# EasyEDA schematic SCH_PCB Schematic_2021-12-08.json
TITLE: Sheet_1; REV: 1.0; Date: 2021-11-09; Sheet: 1/1; Drawn By: sgy222; Company: Your Company
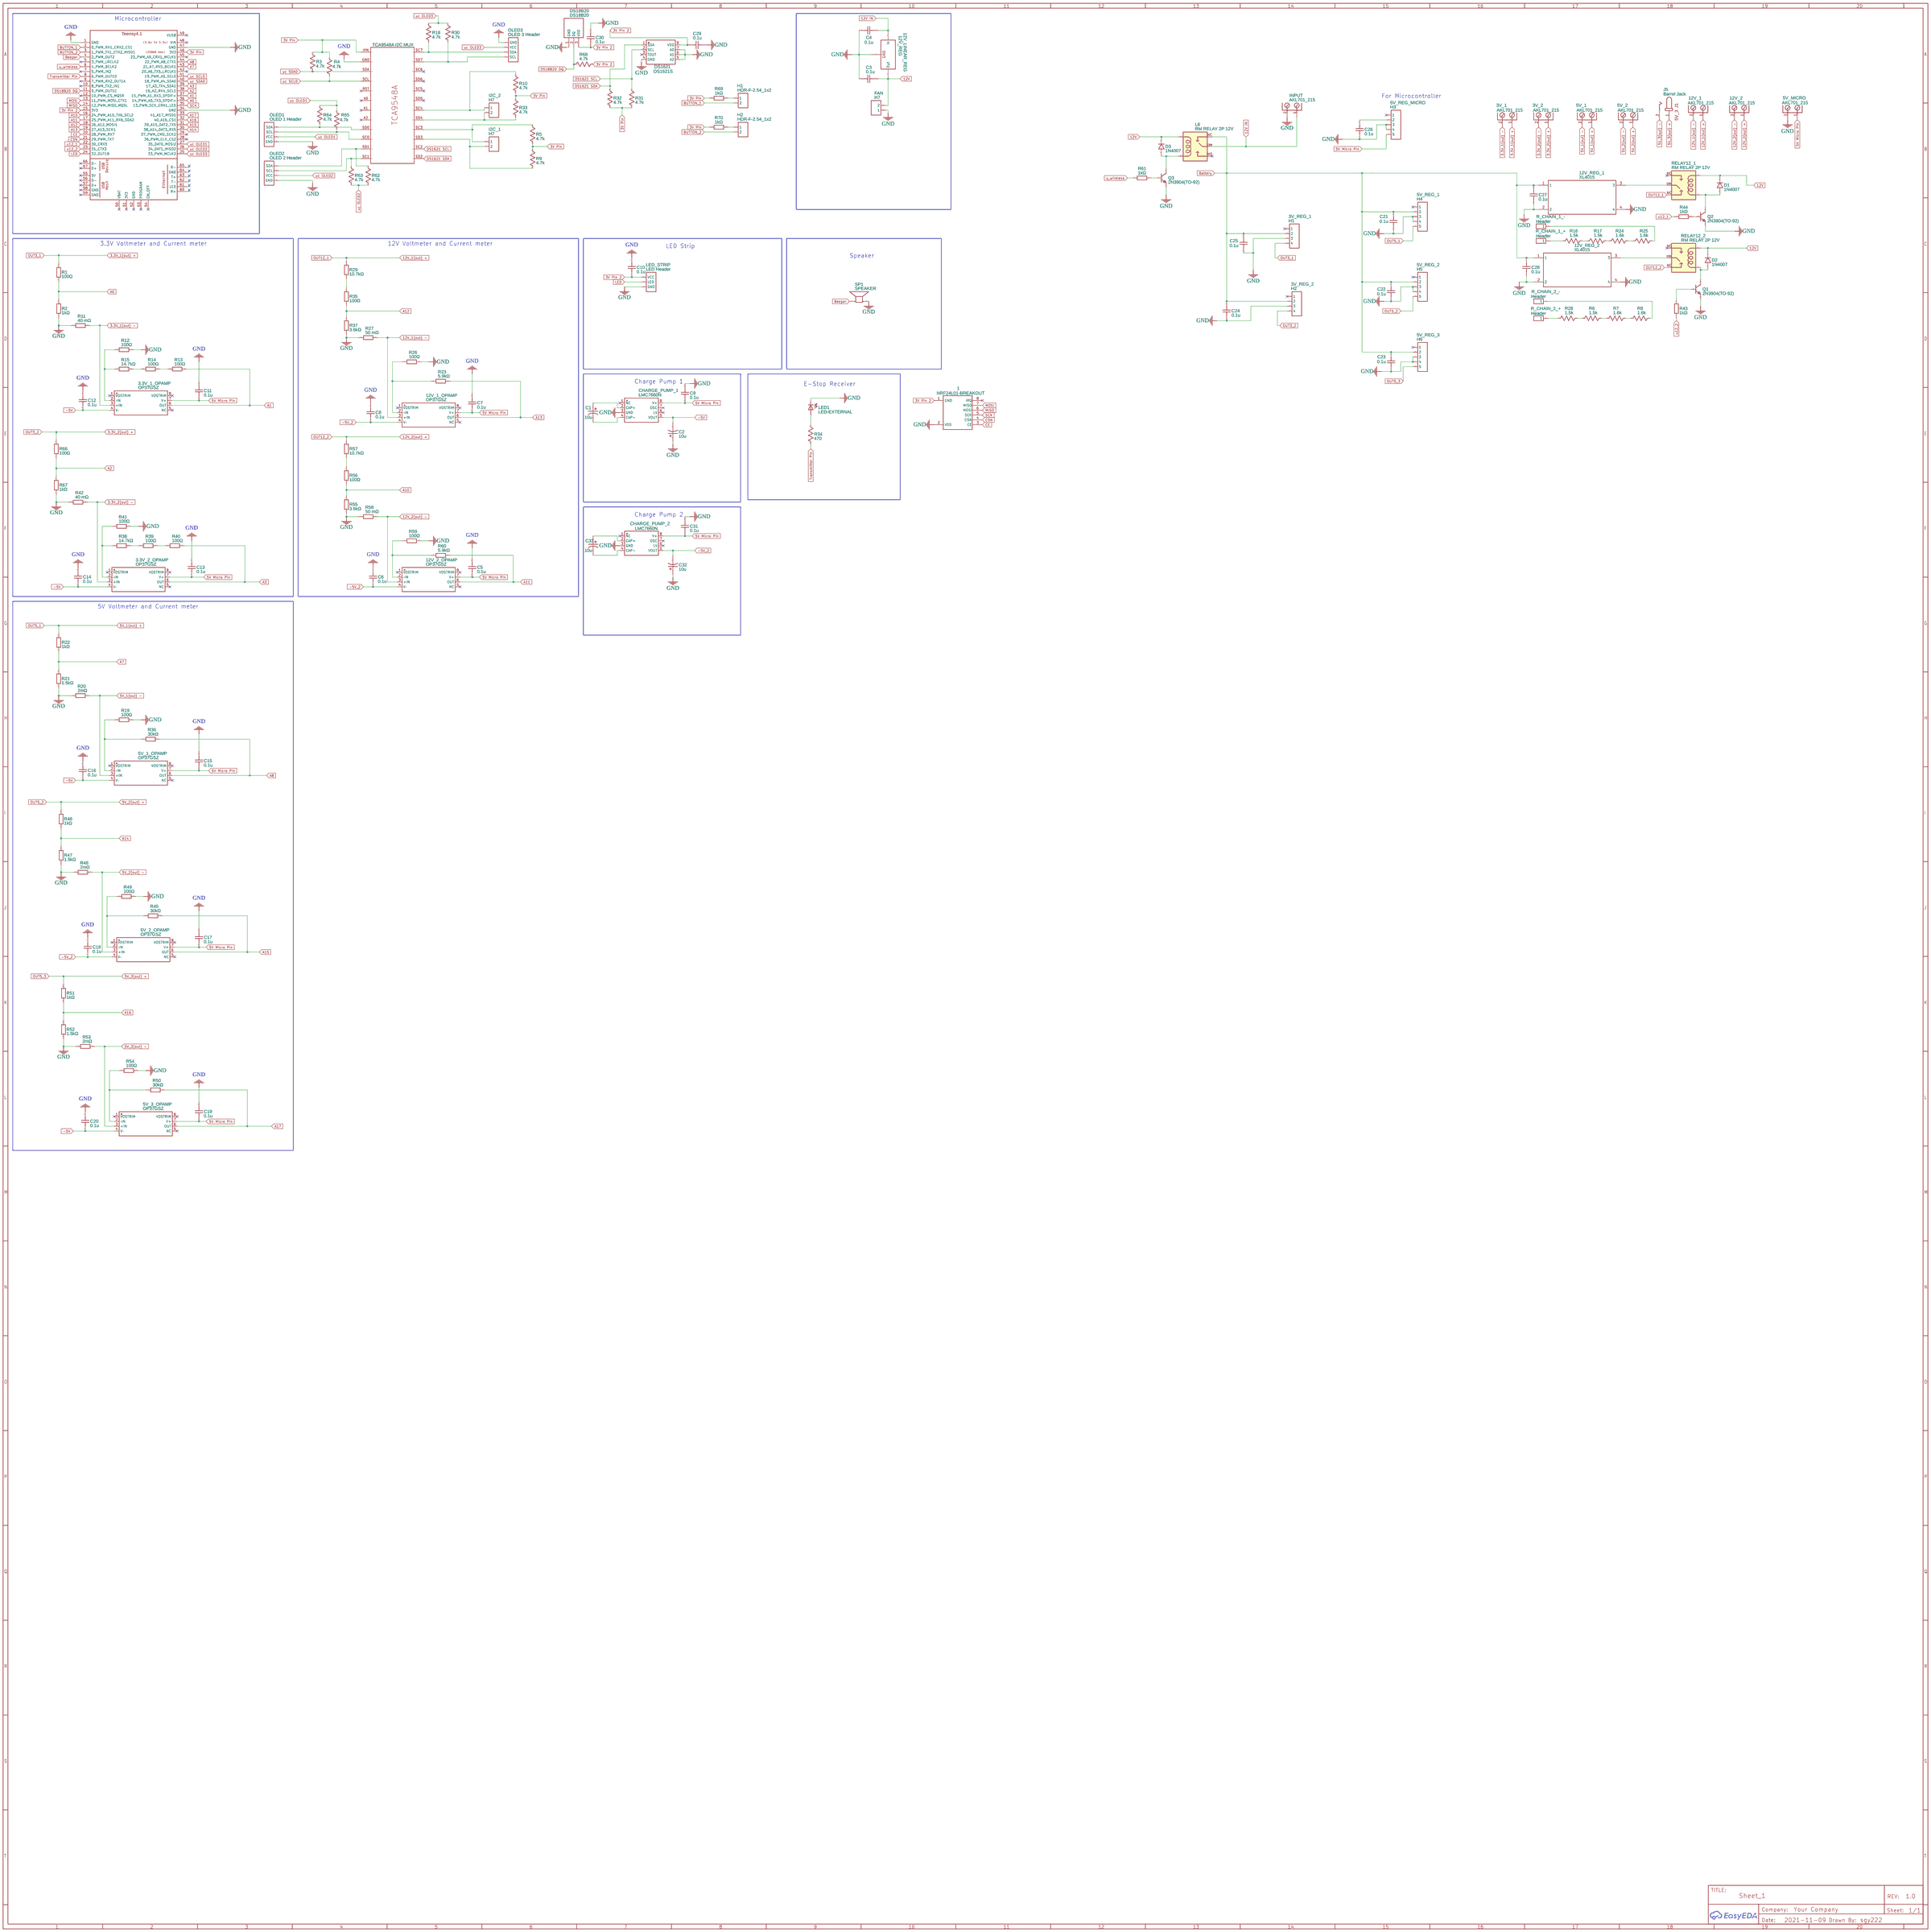
[diagram p0: schematic sheet]

## Parts
1  NRF24L01-BREAKOUT  [NRF24L01-BREAKOUT]
3.3V_1_OPAMP  OP37GSZ  [SOIC-8_L4.9-W3.9-P1.27-LS6.0-BL]
3.3V_2_OPAMP  OP37GSZ  [SOIC-8_L4.9-W3.9-P1.27-LS6.0-BL]
3V_1  AKL701_215  [AKL701_2_15]
3V_2  AKL701_215  [AKL701_2_15]
3V_REG_1  H1  [HDR-F-2.54_1X4]
3V_REG_2  H2  [HDR-F-2.54_1X4]
5V_1  AKL701_215  [AKL701_2_15]
5V_1_OPAMP  OP37GSZ  [SOIC-8_L4.9-W3.9-P1.27-LS6.0-BL]
5V_2  AKL701_215  [AKL701_2_15]
5V_2_OPAMP  OP37GSZ  [SOIC-8_L4.9-W3.9-P1.27-LS6.0-BL]
5V_3_OPAMP  OP37GSZ  [SOIC-8_L4.9-W3.9-P1.27-LS6.0-BL]
5V_MICRO  AKL701_215  [AKL701_2_15]
5V_REG_1  H4  [HDR-F-2.54_1X5]
5V_REG_2  H5  [HDR-F-2.54_1X5]
5V_REG_3  H6  [HDR-F-2.54_1X5]
5V_REG_MICRO  H3  [HDR-F-2.54_1X5]
12V_1  AKL701_215  [AKL701_2_15]
12V_1_OPAMP  OP37GSZ  [SOIC-8_L4.9-W3.9-P1.27-LS6.0-BL]
12V_2  AKL701_215  [AKL701_2_15]
12V_2_OPAMP  OP37GSZ  [SOIC-8_L4.9-W3.9-P1.27-LS6.0-BL]
12V_REG  12V_LINEAR_REG  [VOLTAGEREGULATOR-XXV]
12V_REG_1  XL4015  [XL4015]
12V_REG_2  XL4015  [XL4015]
C1  10u  [CAP-D5.0×F2.0]
C2  10u  [CAP-D5.0×F2.0]
C3  0.1u  [C0603]
C4  0.1u  [C0603]
C5  0.1u  [C0603]
C6  0.1u  [C0603]
C7  0.1u  [C0603]
C8  0.1u  [C0603]
C9  0.1u  [C0603]
C10  0.1u  [C0603]
C11  0.1u  [C0603]
C12  0.1u  [C0603]
C13  0.1u  [C0603]
C14  0.1u  [C0603]
C15  0.1u  [C0603]
C16  0.1u  [C0603]
C17  0.1u  [C0603]
C18  0.1u  [C0603]
C19  0.1u  [C0603]
C20  0.1u  [C0603]
C21  0.1u  [C0603]
C22  0.1u  [C0603]
C23  0.1u  [C0603]
C24  0.1u  [C0603]
C25  0.1u  [C0603]
C26  0.1u  [C0603]
C27  0.1u  [C0603]
C28  0.1u  [C0603]
C29  0.1u  [C0603]
C30  0.1u  [C0603]
C31  0.1u  [C0603]
C32  10u  [CAP-D5.0×F2.0]
C33  10u  [CAP-D5.0×F2.0]
CHARGE_PUMP_1  LMC7660N  [DIP-8_L9.7-W6.4-P2.54-LS7.6-BL]
CHARGE_PUMP_2  LMC7660N  [DIP-8_L9.7-W6.4-P2.54-LS7.6-BL]
D1  1N4007  [DO-41_BD2.4-L4.7-P8.70-D0.9-RD]
D2  1N4007  [DO-41_BD2.4-L4.7-P8.70-D0.9-RD]
D3  1N4007  [DO-41_BD2.4-L4.7-P8.70-D0.9-RD]
DS18B20  DS18B20  [DS18B20]
DS1621  DS1621S  [SO-8_L4.9-W3.9-P1.27-LS5.9-BL]
FAN  H7  [HDR-M-2.54_1X2]
H1  HDR-F-2.54_1x2  [HDR-F-2.54_1X2]
H2  HDR-F-2.54_1x2  [HDR-F-2.54_1X2]
I2C_1  H7  [HDR-M-2.54_1X2]
I2C_2  H7  [HDR-M-2.54_1X2]
INPUT  AKL701_215  [AKL701_2_15]
J5  Barrel Jack  [PJ-037AH]
L8  RM RELAY 2P 12V  [RM RELAY 2P 3.3V]
LED1  LED-EXTERNAL  [2PIN-HEADER-LED]
LED_STRIP  LED Header  [HDR-M-2.54_1X3]
OLED1  OLED 1 Header  [HDR-M-2.54_1X4]
OLED2  OLED 2 Header  [HDR-M-2.54_1X4]
OLED3  OLED 3 Header  [HDR-M-2.54_1X4]
Q1  2N3904(TO-92)  [TO-92-3_L5.1-W4.1-P1.27-L]
Q2  2N3904(TO-92)  [TO-92-3_L5.1-W4.1-P1.27-L]
Q3  2N3904(TO-92)  [TO-92-3_L5.1-W4.1-P1.27-L]
R1  100Ω  [R1206]
R2  1kΩ  [R1206]
R3  4.7k  [R1206]
R4  4.7k  [R1206]
R5  4.7k  [R1206]
R6  1.5k  [R_AXIAL-0.3]
R7  1.6k  [R_AXIAL-0.3]
R8  1.6k  [R_AXIAL-0.3]
R9  4.7k  [R1206]
R10  4.7k  [R1206]
R11  40 mΩ  [R1206]
R12  100Ω  [R1206]
R13  100Ω  [R1206]
R14  100Ω  [R1206]
R15  14.7kΩ  [R1206]
R16  1.5k  [R_AXIAL-0.3]
R17  1.5k  [R_AXIAL-0.3]
R18  4.7k  [R1206]
R19  100Ω  [R1206]
R20  2mΩ  [R1206]
R21  1.5kΩ  [R1206]
R22  1kΩ  [R1206]
R23  5.9kΩ  [R1206]
R24  1.6k  [R_AXIAL-0.3]
R25  1.6k  [R_AXIAL-0.3]
R26  100Ω  [R1206]
R27  50 mΩ  [R1206]
R28  1.5k  [R_AXIAL-0.3]
R29  10.7kΩ  [R1206]
R30  4.7k  [R1206]
R31  4.7k  [R1206]
R32  4.7k  [R1206]
R33  4.7k  [R1206]
R34  470  [THROUGH HOLE RESISTOR]
R35  100Ω  [R1206]
R36  30kΩ  [R0603]
R37  3.6kΩ  [R0603]
R38  14.7kΩ  [R1206]
R39  100Ω  [R1206]
R40  100Ω  [R1206]
R41  100Ω  [R1206]
R42  40 mΩ  [R1206]
R43  1kΩ  [R1206]
R44  1kΩ  [R1206]
R45  30kΩ  [R0603]
R46  1kΩ  [R1206]
R47  1.5kΩ  [R1206]
R48  2mΩ  [R1206]
R49  100Ω  [R1206]
R50  30kΩ  [R0603]
R51  1kΩ  [R1206]
R52  1.5kΩ  [R1206]
R53  2mΩ  [R1206]
R54  100Ω  [R1206]
R55  3.6kΩ  [R0603]
R56  100Ω  [R1206]
R57  10.7kΩ  [R1206]
R58  50 mΩ  [R1206]
R59  100Ω  [R1206]
R60  5.9kΩ  [R1206]
R61  1kΩ  [R1206]
R62  4.7k  [R1206]
R63  4.7k  [R1206]
R64  4.7k  [R1206]
R65  4.7k  [R1206]
R66  100Ω  [R1206]
R67  1kΩ  [R1206]
R68  4.7k  [R1206]
R69  1kΩ  [R1206]
R70  1kΩ  [R1206]
R_CHAIN_1_+  Header  [HDR-M-2.54_1X1]
R_CHAIN_1_-  Header  [HDR-M-2.54_1X1]
R_CHAIN_2_+  Header  [HDR-M-2.54_1X1]
R_CHAIN_2_-  Header  [HDR-M-2.54_1X1]
RELAY12_1  RM RELAY 2P 12V  [RM RELAY 2P 3.3V]
RELAY12_2  RM RELAY 2P 12V  [RM RELAY 2P 3.3V]
SP1  SPEAKER  [SPEAKER]
TEENSY  TEENSY4.1 COMPLETE  [TEENSY4.1 - KB]
U3  TCA9548A I2C MUX  [TCA9548A]

## Library data of the parts
1 = NRF24L01-BREAKOUT: Contributor: BLACKbox Channel
3.3V_1_OPAMP 3.3V_2_OPAMP 5V_1_OPAMP 5V_2_OPAMP 5V_3_OPAMP 12V_1_OPAMP 12V_2_OPAMP = OP37GSZ: Supplier: LCSC; Supplier Part: C690944; Manufacturer: ADI(亚德诺)/LINEAR; Contributor: LCSC
3V_1 3V_2 5V_1 5V_2 5V_MICRO 12V_1 12V_2 INPUT = AKL701_215
3V_REG_1 3V_REG_2 = HDR-F-2.54_1x4: Supplier Part: C225501; Supplier: LCSC; Contributor: LCEDA_Lib
5V_REG_1-5V_REG_3 5V_REG_MICRO = HDR-F-2.54_1x5: Supplier Part: C50950; Supplier: LCSC; Contributor: LCEDA_Lib
12V_REG = VoltageRegulator-xxV: Contributor: hctan22; Package Display: No
12V_REG_1 12V_REG_2 = XL4015: Contributor: kaleo.pretti
C1 C2 C32 C33 = CE_TH_D5.0×F2.0_US: Contributor: LCEDA_Lib
C3-C31 = C_0603_US: Contributor: LCEDA_Lib
CHARGE_PUMP_1 CHARGE_PUMP_2 = LMC7660N: Supplier: LCSC; Supplier Part: C512764; Manufacturer: HGSEMI(华冠); Contributor: LCSC; JLCPCB Part Class: Extended Part
D1-D3 = 1N4007: Supplier: LCSC; Manufacturer: SEMTECH; Supplier Part: C106903; Contributor: LCEDA_Lib
DS18B20 = DS18B20: Contributor: thomas.ragos
DS1621 = DS1621S: Supplier Part: C407894; Manufacturer: Maxim Integrated; Contributor: apol789
FAN I2C_1 I2C_2 = HDR-M-2.54_1x2: Supplier Part: C124375; Supplier: LCSC; Contributor: LCEDA_Lib
H1 H2 = HDR-F-2.54_1x2: Supplier Part: C49661; Supplier: LCSC; Contributor: LCEDA_Lib
J5 = PJ-037AH: Manufacturer: CUI; Contributor: hoff
L8 RELAY12_1 RELAY12_2 = RM RELAY 2P 3.3V
LED1 = LED-EXTERNAL: Contributor: StefMas
LED_STRIP = HDR-M-2.54_1x3: Supplier Part: C180248; Supplier: LCSC; Contributor: LCEDA_Lib
OLED1-OLED3 = HDR-M-2.54_1x4: Supplier Part: C124378; Supplier: LCSC; Contributor: LCEDA_Lib
Q1-Q3 = 2N3904(TO-92): Supplier: LCSC; Manufacturer: SEMTECH; Manufacturer Part: 2N3904; Supplier Part: C118538; Contributor: LCEDA_Lib
R1 R2 R11-R15 R19-R23 R26 R27 R29 R35 R38-R44 R46-R49 R51-R54 R56-R61 R66 R67 R69 R70 = AECR1206F110RK9: Supplier: LCSC; Supplier Part: C352159; Manufacturer: ResistorToday; Contributor: LCSC
R3-R5 R9 R10 R18 R30-R33 R62-R65 R68 = R_1206_US: Contributor: LCEDA_Lib
R6-R8 R16 R17 R24 R25 R28 = R_AXIAL-0.3_US: Contributor: LCEDA_Lib
R34 = 1k 1%: Contributor: ollie.martin
R36 R37 R45 R50 R55 = 0603WAF3022T5E: Supplier: LCSC; Supplier Part: C246852; Manufacturer: Uniroyal Elec; Contributor: LCSC; JLCPCB Part Class: Extended Part
R_CHAIN_1_+ R_CHAIN_1_- R_CHAIN_2_+ R_CHAIN_2_- = HDR-M-2.54_1x1: Supplier Part: C81276; Supplier: LCSC; Contributor: LCEDA_Lib
SP1 = SPEAKER: Contributor: dthal
TEENSY = TEENSY4.1 COMPLETE: Manufacturer: PJRC; Manufacturer Part: Teensy4.1; link: https://www.pjrc.com/store/teensy41.html; Contributor: harryzal26
U3 = Adafruit TCA9548A: Manufacturer: Adafruit; Manufacturer Part: 2717; Supplier: Digi-Key; Supplier Part: 1528-1363-ND; link: https://www.digikey.com/products/en?keywords=1528-1363-ND; Contributor: JohanEThomsen; Supplier 2: Mouser; Supplier 2 Part: 485-2717

## Nets
3.3V_1(out) +: 3V_1.1 3V_REG_1.4 R1.2
3.3V_1(out) -: 3.3V_1_OPAMP.3(+IN) 3V_1.2 R11.2
3.3V_2(out) +: 3V_2.1 3V_REG_2.4 R66.2
3.3V_2(out) -: 3.3V_2_OPAMP.3(+IN) 3V_2.2 R42.2
3V Pin: R3.2 R4.2 R5.1 R9.1 R10.1 R31.1 R32.1 R33.2 R69.2 R70.2 TEENSY.46(3V3) U3.VIN
3V Pin 2: 1.1(GND) C10.1 C29.2 C30.2 DS18B20.3(VDD) DS1621.8(VDD) LED_STRIP.1(VCC) R68.1 TEENSY.15(3V3)
5V Micro Pin: 3.3V_1_OPAMP.7(V+) 3.3V_2_OPAMP.7(V+) 5V_1_OPAMP.7(V+) 5V_2_OPAMP.7(V+) 5V_3_OPAMP.7(V+) 5V_MICRO.1 5V_REG_MICRO.5 12V_1_OPAMP.7(V+) 12V_2_OPAMP.7(V+) C5.1 C7.1 C9.1 C11.1 C13.1 C15.1 C17.1 C19.1 C31.1 CHARGE_PUMP_1.8(V+) CHARGE_PUMP_2.8(V+)
5V_1(out) +: 5V_1.1 5V_REG_1.5 R22.2
5V_1(out) -: 5V_1.2 5V_1_OPAMP.3(+IN) R20.2
5V_2(out) +: 5V_2.1 5V_REG_2.5 R46.2
5V_2(out) -: 5V_2.2 5V_2_OPAMP.3(+IN) R48.2
5V_3(out) +: 5V_REG_3.5 J5.1 R51.2
5V_3(out) -: 5V_3_OPAMP.3(+IN) J5.2 R53.2
12V: 12V_REG.3(Out) C3.2 D1.1 D2.1 D3.1 FAN.2 L8.COIL1 RELAY12_1.COIL2 RELAY12_2.COIL2
12V IN: 12V_REG.1(In) C4.2 INPUT.1 L8.COM
12V_1(out) +: 12V_1.1 R29.2 RELAY12_1.NC
12V_1(out) -: 12V_1.2 12V_1_OPAMP.3(+IN) R27.2
12V_2(out) +: 12V_2.1 R57.2 RELAY12_2.NC
12V_2(out) -: 12V_2.2 12V_2_OPAMP.3(+IN) R58.2
-5V: 3.3V_1_OPAMP.4(V–) 3.3V_2_OPAMP.4(V–) 5V_1_OPAMP.4(V–) 5V_3_OPAMP.4(V–) C2.2 C12.1 C14.1 C16.1 C20.1 CHARGE_PUMP_1.5(VOUT)
-5V_2: 5V_2_OPAMP.4(V–) 12V_1_OPAMP.4(V–) 12V_2_OPAMP.4(V–) C6.2 C8.1 C18.1 C32.2 CHARGE_PUMP_2.5(VOUT)
GND: 1.2(VDD) 3V_REG_1.3 3V_REG_2.3 5V_MICRO.2 5V_REG_1.3 5V_REG_1.4 5V_REG_2.3 5V_REG_2.4 5V_REG_3.3 5V_REG_3.4 5V_REG_MICRO.3 5V_REG_MICRO.4 12V_REG.2(GND) 12V_REG_1.2 12V_REG_1.4 12V_REG_2.2 12V_REG_2.4 C2.1 C3.1 C4.1 C5.2 C6.1 C7.2 C8.2 C9.2 C10.2 C11.2 C12.2 C13.2 C14.2 C15.2 C16.2 C17.2 C18.2 C19.2 C20.2 C21.1 C22.1 C23.1 C24.1 C25.1 C26.1 C27.1 C28.1 C29.1 C30.1 C31.2 C32.1 CHARGE_PUMP_1.3(GND) CHARGE_PUMP_2.3(GND) DS18B20.1(GND) DS1621.4(GND) DS1621.5(A2) DS1621.6(A1) DS1621.7(A0) FAN.1 INPUT.2 LED1.2(K) LED_STRIP.3(GND) OLED1.1(GND) OLED2.1(GND) OLED3.1(GND) Q1.1(E) Q2.1(E) Q3.1(E) R2.1 R11.1 R12.2 R19.2 R20.1 R21.1 R26.2 R27.1 R37.1 R41.2 R42.1 R47.1 R48.1 R49.2 R52.1 R53.1 R54.2 R55.1 R58.1 R59.2 R67.1 SP1.2(-) TEENSY.1(GND) TEENSY.34(GND) TEENSY.47(GND) U3.GND
A0: R1.1 R2.2 TEENSY.36(14_PWM_A0_TX3_SPDIF>)
A1: 3.3V_1_OPAMP.6(OUT) R13.2 TEENSY.37(15_PWM_A1_RX3_SPDIF<)
A2: R66.1 R67.2 TEENSY.38(16_A2_RX4_SCL1)
A3: 3.3V_2_OPAMP.6(OUT) R40.2 TEENSY.39(17_A3_TX4_SDA1)
A7: R21.2 R22.1 TEENSY.43(21_A7_RX5_BCLK1)
A8: 5V_1_OPAMP.6(OUT) R36.2 TEENSY.44(22_PWM_A8_CTX1)
A10: R55.2 R56.1 TEENSY.16(24_PWM_A10_TX6_SCL2)
A11: 12V_2_OPAMP.6(OUT) R60.2 TEENSY.17(25_PWM_A11_RX6_SDA2)
A12: R35.1 R37.2 TEENSY.18(26_A12_MOSI1)
A13: 12V_1_OPAMP.6(OUT) R23.2 TEENSY.19(27_A13_SCK1)
A14: R46.1 R47.2 TEENSY.30(38_A14_DAT3_RX5)
A15: 5V_2_OPAMP.6(OUT) R45.2 TEENSY.31(39_A15_DAT2_TX5)
A16: R51.1 R52.2 TEENSY.32(40_A16_CS1)
A17: 5V_3_OPAMP.6(OUT) R50.2 TEENSY.33(41_A17_MIS01)
Battery: 3V_REG_1.2 3V_REG_2.2 5V_REG_1.2 5V_REG_2.2 5V_REG_3.2 12V_REG_1.1 12V_REG_2.1 C21.2 C22.2 C23.2 C24.2 C25.2 C27.2 C28.2 L8.NC
Beeper: SP1.1(+) TEENSY.4(2_PWM_OUT2)
BUTTON_1: H1.2 TEENSY.2(0_PWM_RX1_CRX2_CS1)
BUTTON_2: H2.2 TEENSY.3(1_PWM_TX1_CTX2_MISO1)
CE: 1.3(CE) TEENSY.20(28_PWM_RX7)
CSN: 1.4(CSN) TEENSY.21(29_PWM_TX7)
DS18B20 DQ: DS18B20.2(DQ) R68.2 TEENSY.11(9_PWM_OUT1C)
DS1621 SCL: DS1621.2(SCL) R31.2 U3.SC2
DS1621 SDA: DS1621.1(SDA) R32.2 U3.SD2
LED: LED_STRIP.2(LED) TEENSY.24(32_OUT1B)
MISO: 1.6(MOSI) TEENSY.14(12_PWM_MISO_MQSL)
MOSI: 1.7(MISO) TEENSY.13(11_PWM_MOSI_CTX1)
SCK: 1.5(SCK) TEENSY.35(13_PWM_SCK_CRX1_LED)
Transmitter Pin: R34.1 TEENSY.8(6_PWM_OUT1D)
u12_1: R44.1 TEENSY.22(30_CRX3)
u12_2: R43.1 TEENSY.23(31_CTX3)
u_wireless: R61.2 TEENSY.6(4_PWM_BCLK2)
uc OLED1: OLED1.2(VCC) R64.2 R65.2 TEENSY.27(35_DAT0_MOSI2)
uc OLED2: OLED2.2(VCC) R62.2 R63.1 TEENSY.26(34_DAT1_MISO2)
uc OLED3: OLED3.2(VCC) R18.2 R30.2 TEENSY.25(33_PWM_MCLK2)
uc SCL0: R4.1 TEENSY.41(19_PWM_A5_SCL0) U3.SCL
uc SDA0: R3.1 TEENSY.40(18_PWM_A4_SDA0) U3.SDA
Net-(3.3V_1_OPAMP-2): 3.3V_1_OPAMP.2(–IN) R12.1 R15.1
Net-(3.3V_2_OPAMP-2): 3.3V_2_OPAMP.2(–IN) R38.1 R41.1
Net-(5V_1_OPAMP-2): 5V_1_OPAMP.2(–IN) R19.1 R36.1
Net-(5V_2_OPAMP-2): 5V_2_OPAMP.2(–IN) R45.1 R49.1
Net-(5V_3_OPAMP-2): 5V_3_OPAMP.2(–IN) R50.1 R54.1
Net-(5V_REG_MICRO-2): 5V_REG_MICRO.2 C26.2
Net-(12V_1_OPAMP-2): 12V_1_OPAMP.2(–IN) R23.1 R26.1
Net-(12V_2_OPAMP-2): 12V_2_OPAMP.2(–IN) R59.1 R60.1
Net-(12V_REG_1-3): 12V_REG_1.3 RELAY12_1.COM
Net-(12V_REG_2-3): 12V_REG_2.3 RELAY12_2.COM
Net-(C1-1): C1.1 CHARGE_PUMP_1.2(CAP+)
Net-(C1-2): C1.2 CHARGE_PUMP_1.4(CAP-)
Net-(C33-1): C33.1 CHARGE_PUMP_2.2(CAP+)
Net-(C33-2): C33.2 CHARGE_PUMP_2.4(CAP-)
Net-(D1-2): D1.2 Q2.3(C) RELAY12_1.COIL1
Net-(D2-2): D2.2 Q1.3(C) RELAY12_2.COIL1
Net-(D3-2): D3.2 L8.COIL2 Q3.3(C)
Net-(H1-1): H1.1 R69.1
Net-(H2-1): H2.1 R70.1
Net-(I2C_1-1): I2C_1.1 R5.2 U3.SC3
Net-(I2C_1-2): I2C_1.2 R9.2 U3.SD3
Net-(I2C_2-1): I2C_2.1 R10.2 U3.SC4
Net-(I2C_2-2): I2C_2.2 R33.1 U3.SD4
Net-(LED1-1): LED1.1(A) R34.2
Net-(OLED1-3): OLED1.3(SCL) R65.1 U3.SC0
Net-(OLED1-4): OLED1.4(SDA) R64.1 U3.SD0
Net-(OLED2-3): OLED2.3(SCL) R63.2 U3.SC1
Net-(OLED2-4): OLED2.4(SDA) R62.1 U3.SD1
Net-(OLED3-3): OLED3.3(SDA) R18.1 U3.SC7
Net-(OLED3-4): OLED3.4(SCL) R30.1 U3.SD7
Net-(Q1-2): Q1.2(B) R43.2
Net-(Q2-2): Q2.2(B) R44.2
Net-(Q3-2): Q3.2(B) R61.1
Net-(R6-1): R6.1 R28.2
Net-(R6-2): R6.2 R7.1
Net-(R7-2): R7.2 R8.1
Net-(R8-2): R8.2 R_CHAIN_2_-.1
Net-(R13-1): R13.1 R14.2
Net-(R14-1): R14.1 R15.2
Net-(R16-1): R16.1 R_CHAIN_1_+.1
Net-(R16-2): R16.2 R17.1
Net-(R17-2): R17.2 R24.1
Net-(R24-2): R24.2 R25.1
Net-(R25-2): R25.2 R_CHAIN_1_-.1
Net-(R28-1): R28.1 R_CHAIN_2_+.1
Net-(R29-1): R29.1 R35.2
Net-(R38-2): R38.2 R39.1
Net-(R39-2): R39.2 R40.1
Net-(R56-2): R56.2 R57.1

Not connected (* = marked no-connect by the designer): 1 8(IRQ)*; 3.3V_1_OPAMP 1(VOSTRIM)* 5(NC)* 8(VOSTRIM)*; 3.3V_2_OPAMP 1(VOSTRIM)* 5(NC)* 8(VOSTRIM)*; 3V_REG_1 1*; 3V_REG_2 1*; 5V_1_OPAMP 1(VOSTRIM)* 5(NC)* 8(VOSTRIM)*; 5V_2_OPAMP 1(VOSTRIM)* 5(NC)* 8(VOSTRIM)*; 5V_3_OPAMP 1(VOSTRIM)* 5(NC)* 8(VOSTRIM)*; 5V_REG_1 1*; 5V_REG_2 1*; 5V_REG_3 1*; 5V_REG_MICRO 1*; 12V_1_OPAMP 1(VOSTRIM)* 5(NC)* 8(VOSTRIM)*; 12V_2_OPAMP 1(VOSTRIM)* 5(NC)* 8(VOSTRIM)*; CHARGE_PUMP_1 1(NC)* 6(LV)* 7(OSC)*; CHARGE_PUMP_2 1(NC)* 6(LV)* 7(OSC)*; DS1621 3(TOUT)*; L8 NO*; RELAY12_1 NO*; RELAY12_2 NO*; TEENSY 5(3_PWM_LRCLK2)* 7(5_PWM_IN2)* 9(7_PWM_RX2_OUT1A)* 10(8_PWM_TX2_IN1)* 12(10_PWM_CS_MQSR)* 28(36_PWM_CLK_CS2)* 29(37_PWM_CMD_SCK2)* 42(20_A6_TX5_LRCLK1)* 45(23_PWM_A9_CRX1_MCLK1)* 48(VIN)* 49(VUSB)* 50(VBAT)* 51(3V3)* 52(GND)* 53(PROGRAM)* 54(ON_OFF)* 55(5V)* 56(D-)* 57(D+)* 58(GND)* 59(GND)* 60(R+) 61(LED) 62(T-) 63(T+) 64(GND) 65(R-) 66(D-)* 67(D+)*; U3 A0* A1* A2* RST* SC5* SC6* SD5* SD6*

## Notes on the sheet
- Microcontroller
- For Microcontroller
- 3.3V Voltmeter and Current meter
- 12V Voltmeter and Current meter
- LED Strip
- Speaker
- Charge Pump 1
- E-Stop Receiver
- Charge Pump 2
- 5V Voltmeter and Current meter
